# Altium schematic sheet CAN.SchDoc
size A; SheetNumber: 3; SheetTotal: 5
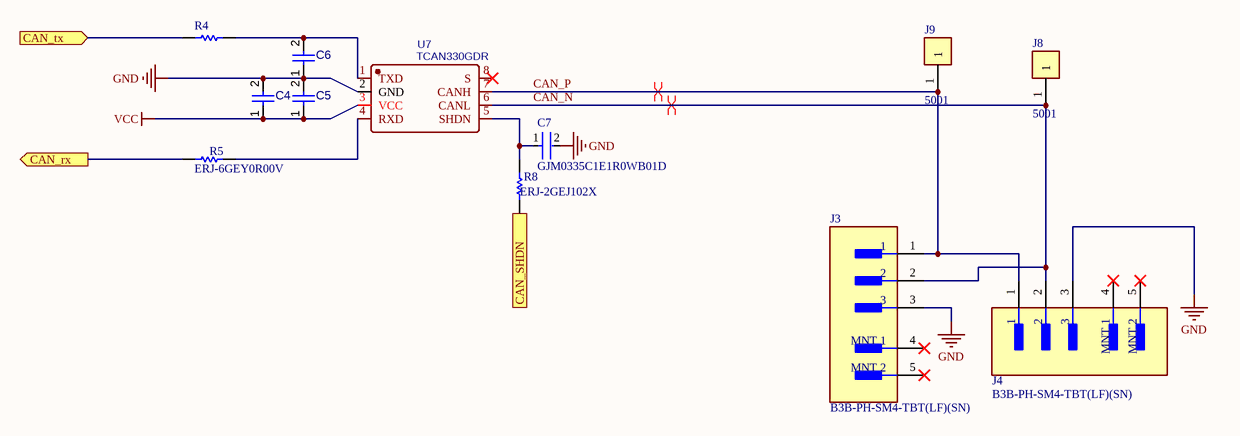
[diagram p0: CAN.SchDoc]

## Parts
C4  KGM15CR71C105JT  [CAP-0603]  (value not drawn)
C5  KGM15CR71C105JT  [CAP-0603]  (value not drawn)
C6  KGM15CR71C105JT  [CAP-0603]  (value not drawn)
C7  GJM0335C1E1R0WB01D  [FP-GJM033-0_03-IPC_A]
J3  B3B-PH-SM4-TBT(LF)(SN)  [FP-B3B-PH-SM4-TBT_LF_SN-MFG]
J4  B3B-PH-SM4-TBT(LF)(SN)  [FP-B3B-PH-SM4-TBT_LF_SN-MFG]
J8  5001  [FP-5001-MFG]
J9  5001  [FP-5001-MFG]
R4  ERJ-6GEY0R00V  [RESC2013X70X40NL20T20]  (value not drawn)
R5  ERJ-6GEY0R00V  [RESC2013X70X40NL20T20]
R8  ERJ-2GEJ102X  [RESC1005X40X25NL05T05]
U7  TCAN330GDR  [IC-BUCK-8SOIC]

## Ports
CAN_rx (out), CAN_SHDN (in), CAN_tx (in)

## Nets
GND: C4.2 C5.2 C6.1 C7.2 J3.3 J4.3 U7.2(GND)
VCC: C4.1 C5.1 U7.3(VCC)
CAN_N: J3.2 J4.2 J8.1 U7.6(CANL)
CAN_P: J3.1 J4.1 J9.1 U7.7(CANH)
CAN_rx: R5.1 ; port CAN_rx
CAN_SHDN: R8.1 ; port CAN_SHDN
CAN_tx: R4.1 ; port CAN_tx
NetC6_2: C6.2 R4.2 U7.1(TXD)
NetC7_1: C7.1 R8.2 U7.5(SHDN)
NetR5_2: R5.2 U7.4(RXD)

Not connected (* = marked no-connect by the designer): J3 4(MNT_1)* 5(MNT_2)*; J4 4(MNT_1)* 5(MNT_2)*; U7 8(S)*

## Layout directives
differential pair: CAN_N, CAN_P

## Library data of the parts
C4-C6 = CMP-001-00090-1: Cap Cer 1UF 16V X7R 0603
C7 = CMP-2010-00803-2: Ceramic Capacitor 1pF ±0.05pF 25V C0G 0201 (0603 Metric); Packaging: Tape and Reel; Lead Free: Lead Free; Voltage Rating (DC): 25V; Termination: SMD/SMT; Capacitance: 1pF; Height: 0.3mm; Case Code (Imperial): 0201; Thickness: 0.013inch; Max Operating Temperature: 125°C; Length: 0.6mm; Case/Package: 0201; Voltage Rating: 25V; Case Code (Metric): 0603; Radiation Hardening: No; Width: 0.3mm; Min Operating Temperature: -55°C; Mount: Surface Mount; Package Quantity: 15000; Depth: 0.3mm; Dielectric: C0G
J3 J4 = CMP-17439-000306-1: CONN HEADER SMD 3POS 2MM; Contact Resistance: 20mR; Max Voltage Rating (AC): 100V; Number of Positions: 3; Pitch: 0.079inch; Mated Stacking Heights: 8.6mm; Max Current Rating: 2A; Fastening Type: Detent; Max Operating Temperature: 85°C; Termination: Solder; Mount: Surface Mount; Contact Finish - Mating: TIN; Min Operating Temperature: -25°C; Housing Color: Beige; Packaging: Tape and Reel; Insulation Color: Natural; Length: 9.95mm; Flammability Rating: UL94 V-0; Connector Type: Header; Contact Material: Copper Alloy; Insulation Material: Nylon; Lead Free: Lead Free; Contact Plating: Tin; Contact Shape: Square; Number of Rows: 1; Color: Natural; Package Quantity: 10; Depth: 5mm; Voltage Rating: 100V; Housing Material: Polyamide; Contact Type: Male Pin; Series: PH; Orientation: Straight; Contact Mating Length: 0.13inch
J8 J9 = CMP-2000-05181-2: PC TEST POINT MINIATURE BLACK; Body Material: Bronze; Plating: Silver; Inside Diameter: 1.27mm; Hole Diameter: 1.6mm; Number of Ports: 1; Outside Diameter: 2.54mm; Insulation: Insulated; Insulation Material: Nylon; Mount: Through Hole; RoHS Compliant: Yes; Series: THM; Height: 0.3inch; Termination: Through Hole; Material: Nylon; Packaging: Bulk; Contact Material: Bronze; REACH SVHC: No SVHC; Contact Plating: Silver; Orientation: Straight; Lead Free: Lead Free; Package Quantity: 100; Length: 7.62mm; Flammability Rating: UL94 V-0; Number of Contacts: 1; Diameter: 2.54mm; Housing Color: Black; Color: Black
R4 R5 = CMP-1665-00002-5: Chip Resistor, 0 Ohm, +/- 1%, 0.125 W, -55 to 155 degC, 0805 (2012 Metric), RoHS, Tape and Reel; Tolerance: 5%; Resistance: 0 Ohm; REACH SVHC: No SVHC; Min Operating Temperature: -55 degC; Case/Package: 0805; Packaging: Tape and Reel; Package Quantity: 5000; ComponentLink1Description: Manufacturer URL; PackageDescription: 2-Pin Surface Mount Device, Body 2 x 1.25 mm; Mounting Technology: Surface Mount; Max Operating Temperature: 155 degC; PartNumber: ERJ-6GEY0R00V; Width: 1.25 mm; RoHSCompliant: True; Height: 0.6 mm; ComponentLink1URL: http://www.panasonic.com/; ComponentLink2URL: http://industrial.panasonic.com/cdbs/www-data/pdf/RDA0000/AOA0000C84.pdf; Case Code (Imperial): 0805; DatasheetVersion: 03/2015; Length: 2 mm; Case Code (Metric): 2012; ComponentLink2Description: Datasheet; Radiation Hardening: No
R8 = CMP-2002-00432-1: Manufacturer: Panasonic; Part Number: ERJ-2GEJ102X
U7 = TCAN330GDR: BOM_Manufacturer: TI(德州仪器); Contributor: LCSC; BOM_Supplier: LCSC; BOM_Supplier Part: C191009; BOM_Manufacturer Part: TCAN330GDR; BOM_JLCPCB Part Class: Extended Part; spicePre: U; spiceSymbolName: TCAN330GDR